# EAGLE design fonte (EAGLE 9.6.2)
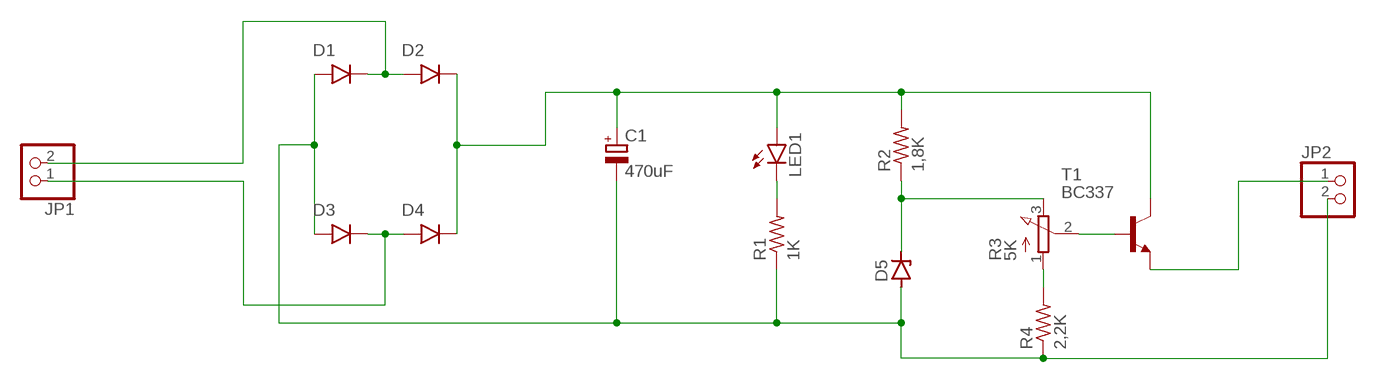
[diagram p0: schematic, sheet 1]

## Parts
C1  470uF  CPOL-EUE3.5-10  [E3,5-10]
D1  1N4001  [DO41-10]
D2  1N4001  [DO41-10]
D3  1N4001  [DO41-10]
D4  1N4001  [DO41-10]
D5  ZENER-DIODEDO34-7  [DO34Z7]
JP1  PINHD-1X2  [1X02]
JP2  PINHD-1X2  [1X02]
LED1  LED5MM  [LED5MM]
R1  1K  R-US_0309/12  [0309/12]
R2  1,8K  R-US_0309/12  [0309/12]
R3  5K  3RP/1610N  [3RP/1610N]
R4  2,2K  R-US_0309/12  [0309/12]
T1  BC337  [TO92]

## Nets
N$1: D1.C(CATHODE) D2.A(ANODE) JP1.2
N$2: D3.C(CATHODE) D4.A(ANODE) JP1.1
N$3: C1.- D1.A(ANODE) D3.A(ANODE) D5.A JP2.2 R1.1 R4.1
N$4: C1.+ D2.C(CATHODE) D4.C(CATHODE) LED1.A R2.2 T1.3(C)
N$5: D5.C R2.1 R3.3(E)
N$6: R3.1(A) R4.2
N$7: LED1.K(C) R1.2
N$8: R3.2(S) T1.2(B)
N$9: JP2.1 T1.1(E)

## Library data of the parts
C1 = rcl:CPOL-EU: POLARIZED CAPACITOR, European symbol; SPICEPREFIX: C
D1-D4 = tango:1N4001: DIODE general purpose rectifier, 1 A
D5 = diode:ZENER-DIODE: Z-Diode
JP1 JP2 = pinhead:PINHD-1X2: PIN HEADER
LED1 = led:LED: LED OSRAM: - CHIPLED LG R971, LG N971, LY N971, LG Q971, LY Q971, LO R971, LY R971 LH N974, LH R974 LS Q976, LO Q976, LY Q976 LO Q996 - Hyper CHIPLED LW Q18S LB Q993, LB Q99A, LB R99A - SideLED LS A670, LO A670, LY A670, LG A670, LP A670 LB A673, LV A673, LT A673, LW A673 LH A674 LY A675 LS A676, LA A676, LO A676, LY A676, LW A676 LS A679, LY A679, LG A679 - Hyper Micro SIDELED® LS Y876, LA Y876, LO Y876, LY Y876 LT Y87S - SmartLED LW L88C, LW L88S LB L89C, LB L89S, LG L890 LS L89K, LO L89K, LY L89K LS L896, LA L896, LO L896, LY L896 - TOPLED LS T670, LO T670, LY T670, LG T670, LP T670 LSG T670, LSP T670, LSY T670, LOP T670, LYG T670 LG T671, LOG T671, LSG T671 LB T673, LV T673, LT T673, LW T673 LH T674 LS T676, LA T676, LO T676, LY T676, LB T676, LH T676, LSB T676, LW T676 LB T67C, LV T67C, LT T67C, LS T67K, LO T67K, LY T67K, LW E67C LS E67B, LA E67B, LO E67B, LY E67B, LB E67C, LV E67C, LT E67C LW T67C LS T679, LY T679, LG T679 LS T770, LO T770, LY T770, LG T770, LP T770 LB T773, LV T773, LT T773, LW T773 LH T774 LS E675, LA E675, LY E675, LS T675 LS T776, LA T776, LO T776, LY T776, LB T776 LHGB T686 LT T68C, LB T68C - Hyper Mini TOPLED® LB M676 - Mini TOPLED Santana® LG M470 LS M47K, LO M47K, LY M47K Source: http://www.osram.convergy.de LUXEON: - LUMILED® LXK2-PW12-R00, LXK2-PW12-S00, LXK2-PW14-U00, LXK2-PW14-V00 LXK2-PM12-R00, LXK2-PM12-S00, LXK2-PM14-U00 LXK2-PE12-Q00, LXK2-PE12-R00, LXK2-PE12-S00, LXK2-PE14-T00, LXK2-PE14-U00 LXK2-PB12-K00, LXK2-PB12-L00, LXK2-PB12-M00, LXK2-PB14-N00, LXK2-PB14-P00, LXK2-PB14-Q00 LXK2-PR12-L00, LXK2-PR12-M00, LXK2-PR14-Q00, LXK2-PR14-R00 LXK2-PD12-Q00, LXK2-PD12-R00, LXK2-PD12-S00 LXK2-PH12-R00, LXK2-PH12-S00 LXK2-PL12-P00, LXK2-PL12-Q00, LXK2-PL12-R00 Source: www.luxeon.com KINGBRIGHT: KA-3528ASYC Source: www.kingbright.com
R1 R2 R4 = rcl:R-US_: RESISTOR, American symbol; SPICEPREFIX: R
R3 = pot:3RP/1610N: 16mm Potentiometer one level Source: http://www.alphapotentiometers.net/html/16mm_pot_2.html
T1 = transistor:BC337: NPN TRANSISTOR

## Board
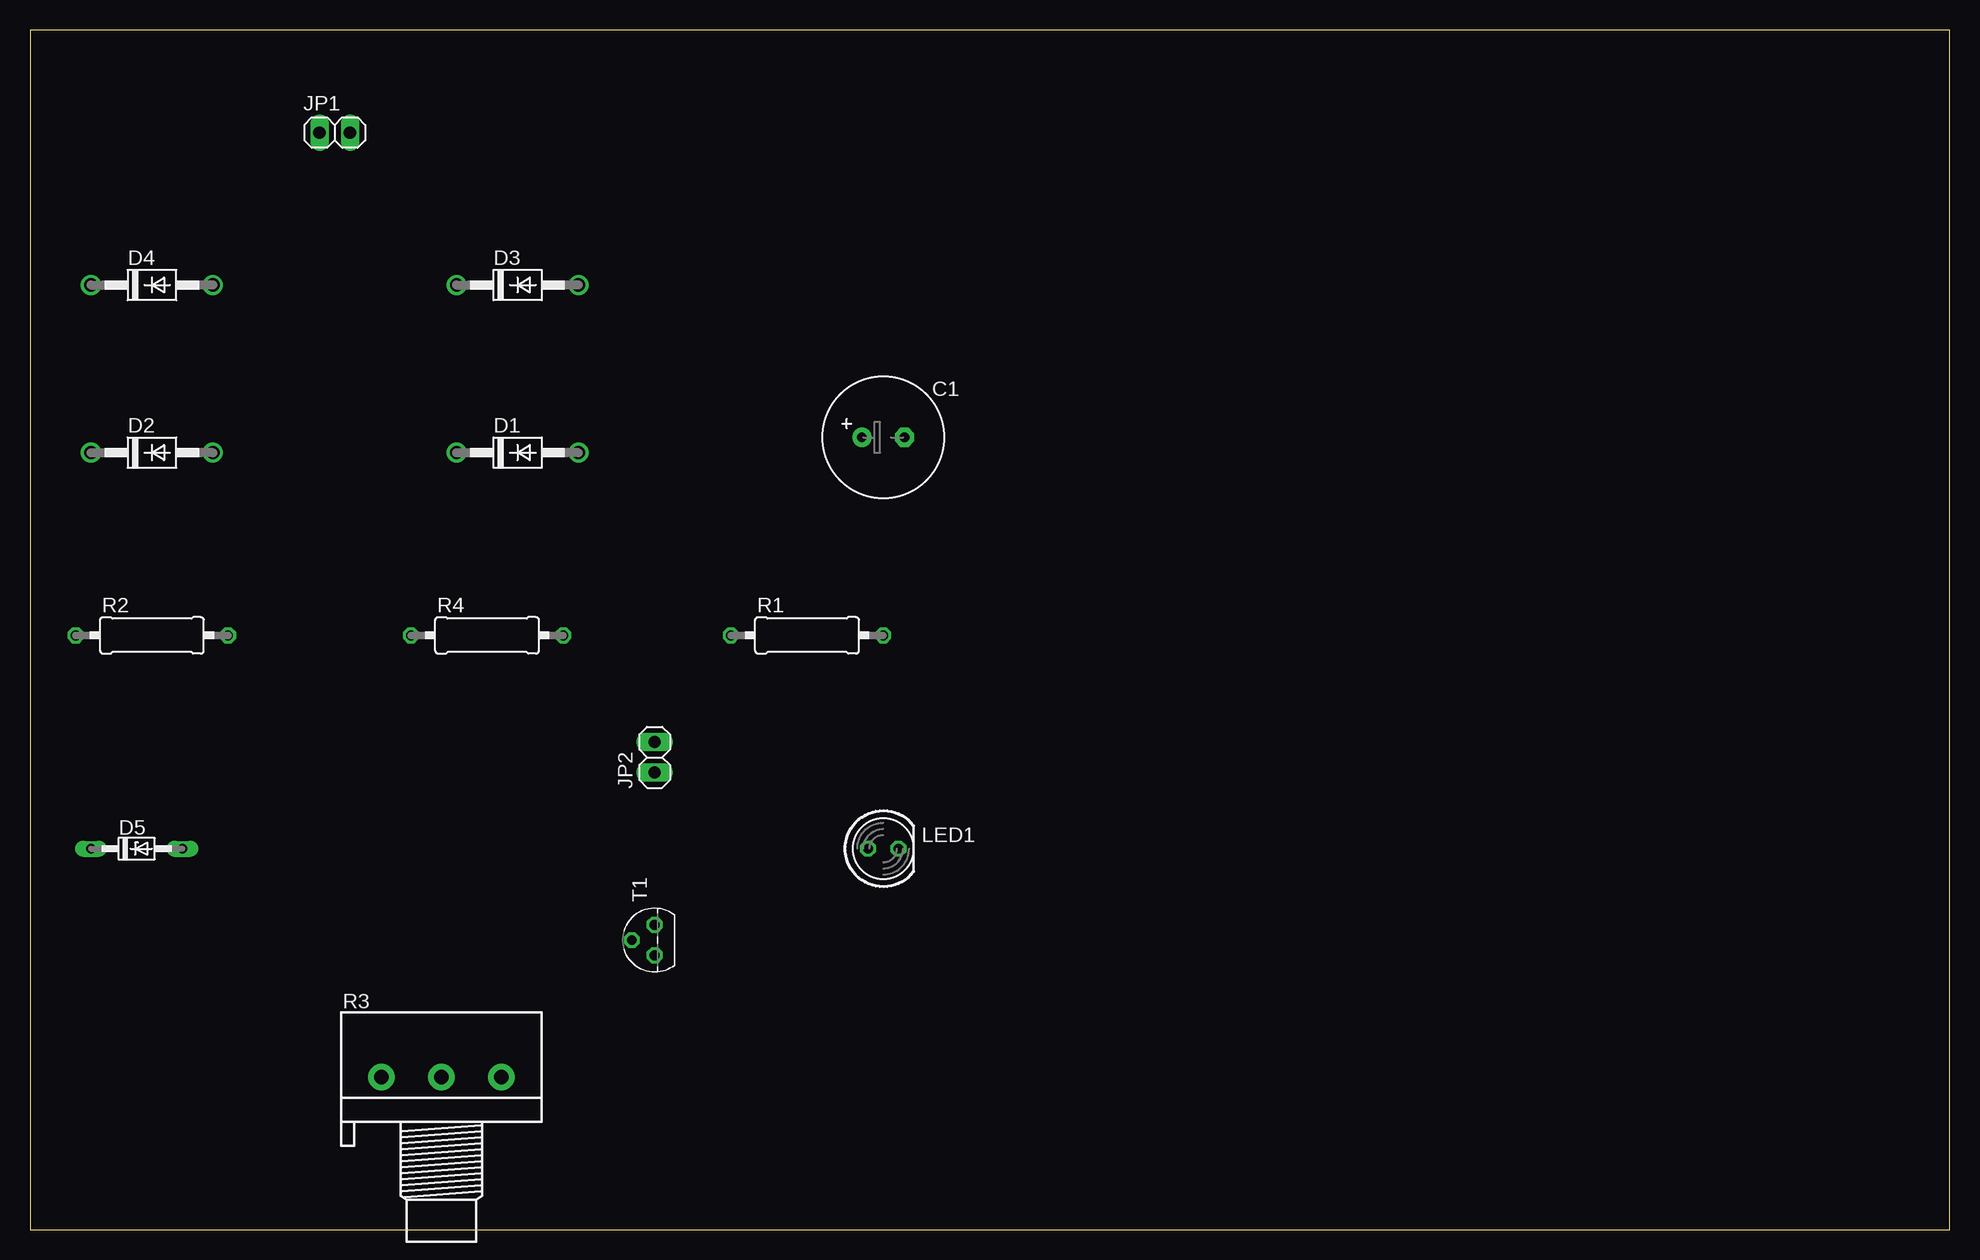
[diagram p1: board, top side]
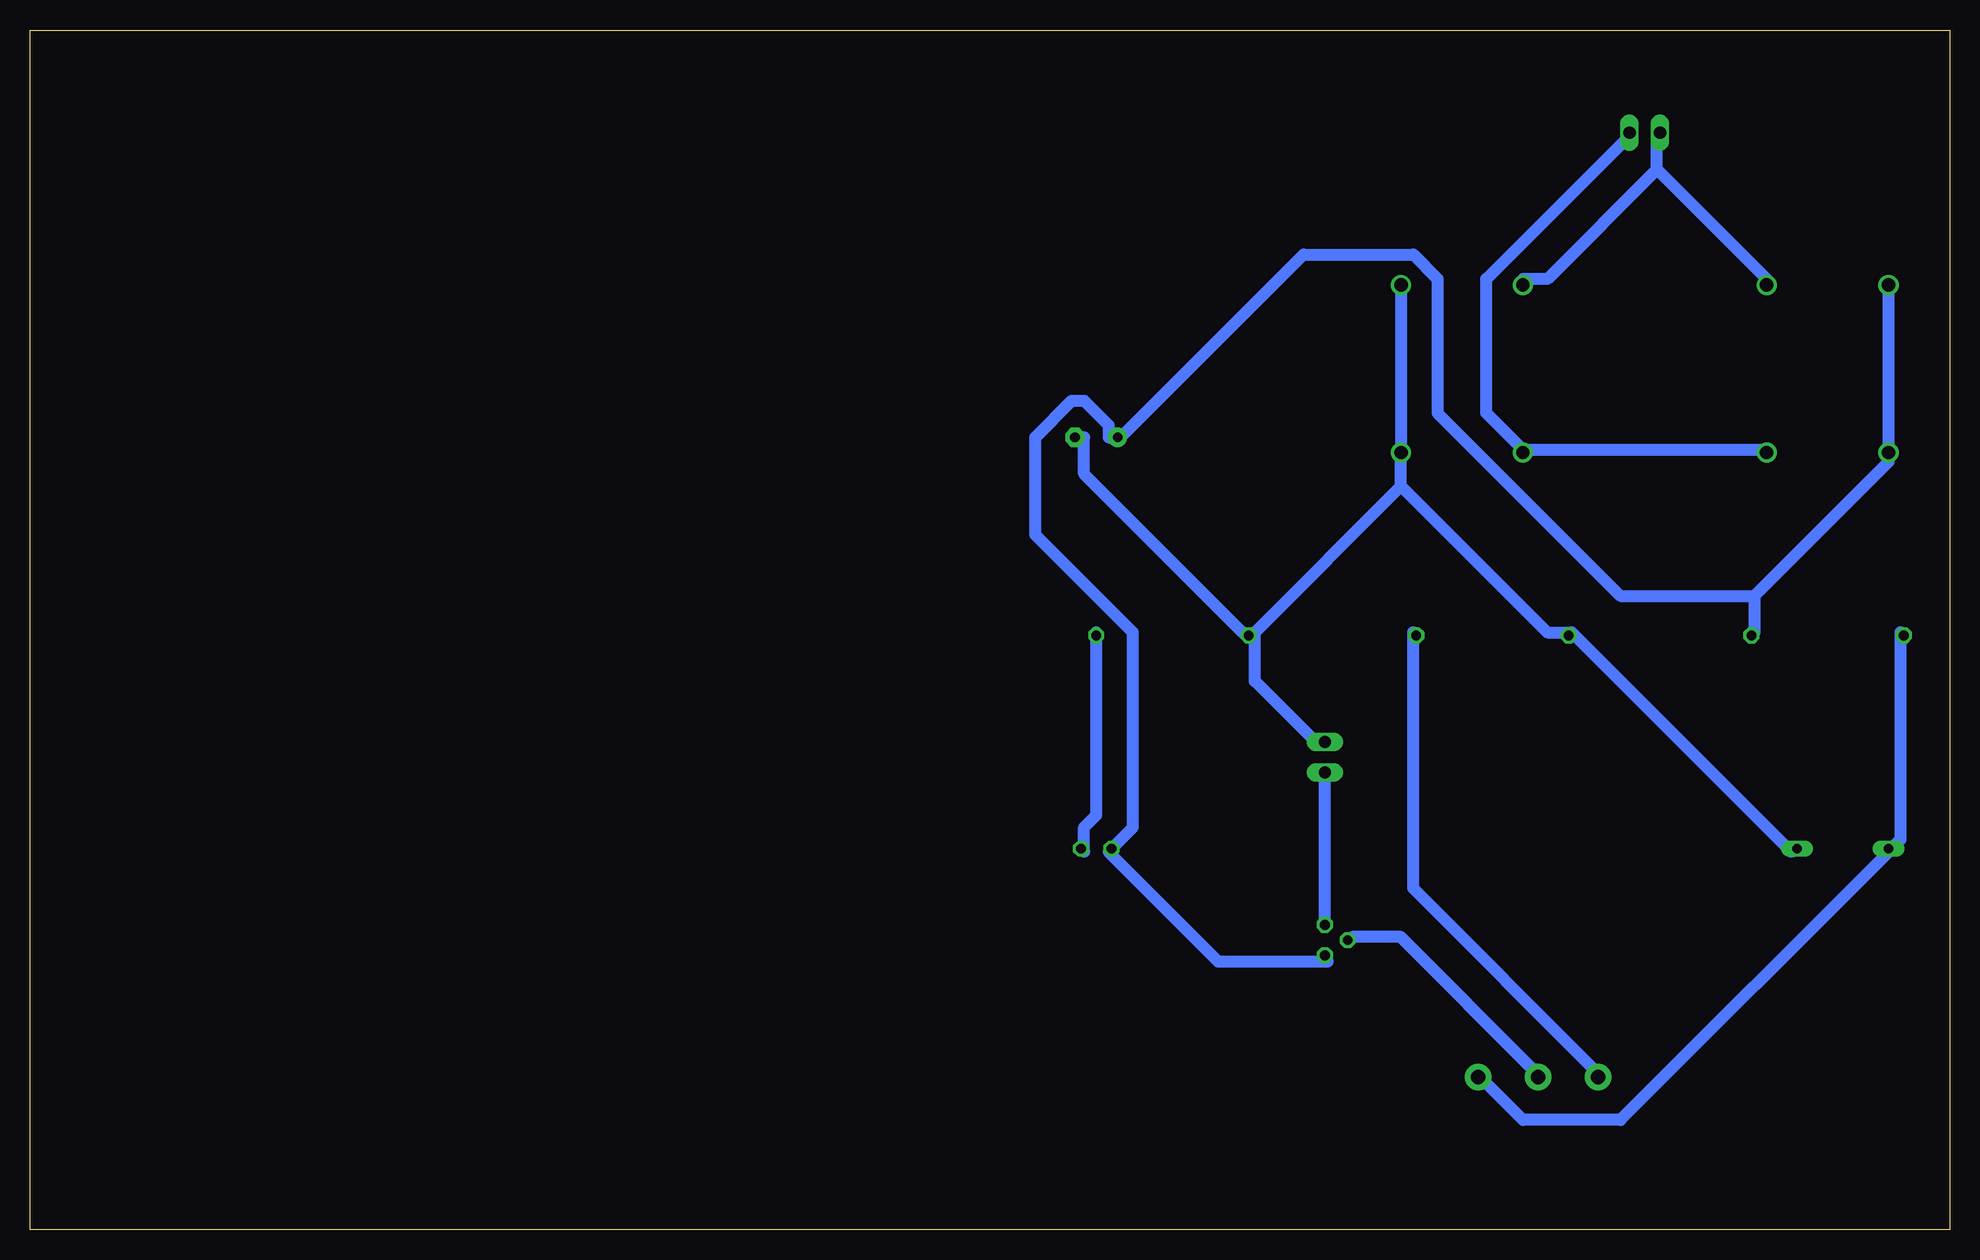
[diagram p2: board, bottom side, seen from below]

Size 160 x 100 mm. Coordinates in mm from the lower left corner, seen from the top.
Outline: 0,0 160,0 160,100 0,100 0,0
Copper layers (1*16): Top 0.035mm / dielectric 1.5mm / Bottom 0.035mm
Design rules "default *": minimum track width 40mil, minimum drill 0.35mm, track to track 40mil, track to pad 40mil, pad to pad 40mil, via to via 40mil, smd to smd 6mil, copper to edge 40mil, drill to drill 6mil, minimum pad ring 10mil, minimum via ring 8mil, stop-mask expansion 4mil, vias tented up to drill 0mil, thermal gap 10mil

### Footprints (pad centres in the part's own frame; a part is rotated, then mirrored left to right if it is on the bottom)
E3,5-10 = drill 0.813 pad 1.6: + -1.778,0 | drill 0.813 pad 1.6 octagon: - 1.778,0
DO41-10 = drill 1.118: A 5.08,0; C -5.08,0
DO34Z7 = drill 0.813 long: A 3.81,0; C -3.81,0
1X02 = drill 1.016 long: 1 -1.27,0; 2 1.27,0
LED5MM = drill 0.813 octagon: A -1.27,0; K 1.27,0
0309/12 = drill 0.813 octagon: 1 -6.35,0; 2 6.35,0
3RP/1610N = drill 1.2 pad 2.184: 1 -5,0; 2 0,0; 3 5,0
TO92 = drill 0.813 octagon: 1 1.27,0; 2 0,1.905; 3 -1.27,0

### Placement (x,y rotation side)
C1  71.12,66.04 0 top
D1  40.64,64.77 0 top
D2  10.16,64.77 0 top
D3  40.64,78.74 0 top
D4  10.16,78.74 0 top
D5  8.89,31.75 0 top
JP1  25.4,91.44 0 top
JP2  52.07,39.37 90 top
LED1  71.12,31.75 0 top
R1  64.77,49.53 0 top
R2  10.16,49.53 0 top
R3  34.29,12.7 0 top
R4  38.1,49.53 0 top
T1  52.07,24.13 90 top

### Tracks (layer width: path | path; a pad name or v marks a point on that pad's centre or on a via)
N$1
  Bottom 1.016: 35.56,65.02 38.61,68.07 38.61,79.25 26.42,91.44 JP1.2 | 35.56,65.02 15.24,65.02 D2.A | 35.56,65.02 D1.C
N$2
  Bottom 1.016: 24.38,88.39 24.38,91.44 JP1.1 | 24.38,88.39 15.24,79.25 D4.A | 24.38,88.39 33.53,79.25 35.56,79.25 D3.C
N$3
  Bottom 1.016: 31.5,49.78 13.21,31.5 D5.A | D3.A D1.A 45.72,61.98 | 57.91,49.78 57.91,45.72 52.83,40.64 JP2.2 | C1.- 72.14,66.04 72.14,62.99 58.93,49.78 R1.1 57.91,49.78 | 57.91,49.78 45.72,61.98 | 31.5,49.78 33.53,49.78 45.72,61.98 | 31.5,49.78 R4.1
N$4
  Bottom 1.016: 16.26,52.83 16.26,49.78 R2.2 | 16.26,52.83 5.08,64.01 D2.C D4.C | T1.3 51.82,22.35 60.96,22.35 70.1,31.5 LED1.A 68.07,33.53 68.07,49.78 76.2,57.91 76.2,66.04 73.15,69.09 72.14,69.09 70.1,67.06 70.1,66.04 C1.+ 69.09,66.04 53.85,81.28 44.7,81.28 42.67,79.25 42.67,68.07 27.43,52.83 16.26,52.83
N$5
  Bottom 1.016: 5.08,31.5 4.06,32.51 4.06,49.78 R2.1 | 5.08,31.5 27.43,9.14 35.56,9.14 38.61,12.19 R3.3 | 5.08,31.5 D5.C
N$6
  Bottom 1.016: R4.2 44.7,49.78 44.7,28.45 29.46,13.21 R3.1
N$7
  Bottom 1.016: 71.12,49.78 R1.2 71.12,34.54 72.14,33.53 72.14,31.5 LED1.K
N$8
  Bottom 1.016: T1.2 49.78,24.38 45.72,24.38 34.54,13.21 R3.2
N$9
  Bottom 1.016: T1.1 JP2.1